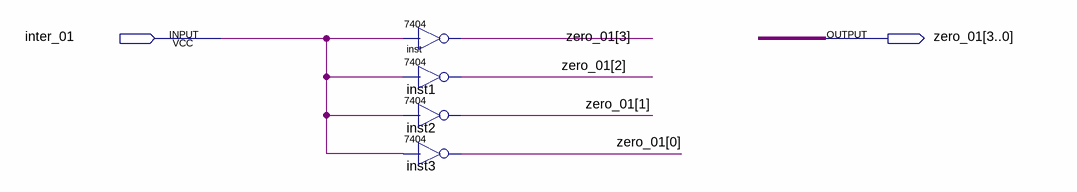
[diagram p0: schematic sheet]
// Quartus schematic inter.bdf as structural Verilog: 4 symbols, 2 pins
module inter (
  input  inter_01,
  output [3:0] zero_01
);

  \7404  inst (.\2 (inter_01), .\1 (zero_01[3]));
  \7404  inst1 (.\2 (inter_01), .\1 (zero_01[2]));
  \7404  inst2 (.\2 (inter_01), .\1 (zero_01[1]));
  \7404  inst3 (.\2 (inter_01), .\1 (zero_01[0]));
endmodule
